# EAGLE design oa_sevenfortyfun (EAGLE 7.1.0)
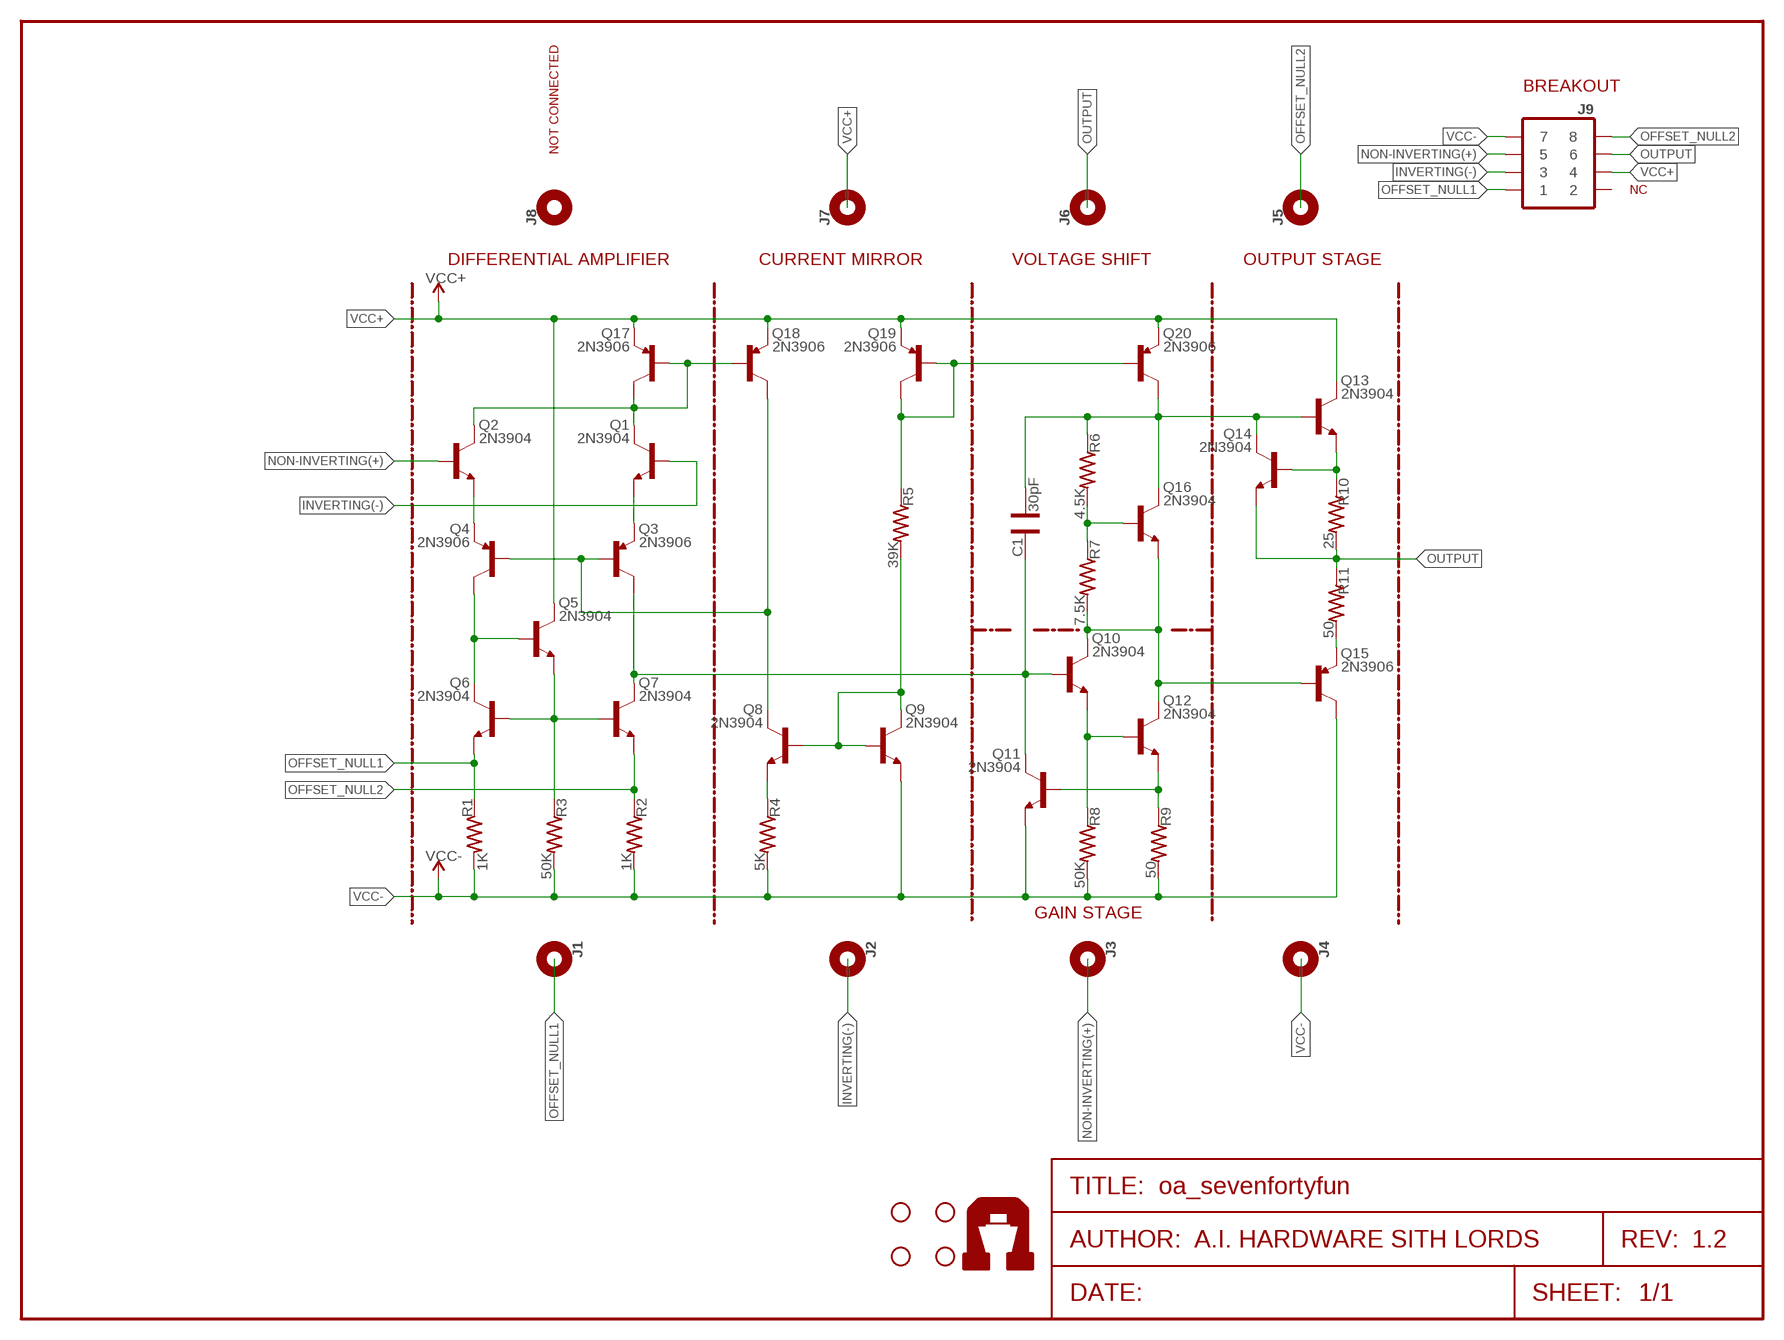
[diagram p0: schematic, sheet 1]
FRAME1 (FRAME-LETTER): AUTHOR: A.I. HARDWARE SITH LORDS; REV: 1.2

## Parts
C1  30pF  CAP025X050  [CAP-025X050]
J1  1X01-TERM  [1X01-TERM]
J2  1X01-TERM  [1X01-TERM]
J3  1X01-TERM  [1X01-TERM]
J4  1X01-TERM  [1X01-TERM]
J5  1X01-TERM  [1X01-TERM]
J6  1X01-TERM  [1X01-TERM]
J7  1X01-TERM  [1X01-TERM]
J8  1X01-TERM  [1X01-TERM]
J9  2X04SHR  [2X04-SHR]
Q1  2N3904  BJT-NPN  [TO-92-NPN]
Q2  2N3904  BJT-NPN  [TO-92-NPN]
Q3  2N3906  BJT-PNP  [TO-92-PNP]
Q4  2N3906  BJT-PNP  [TO-92-PNP]
Q5  2N3904  BJT-NPN  [TO-92-NPN]
Q6  2N3904  BJT-NPN  [TO-92-NPN]
Q7  2N3904  BJT-NPN  [TO-92-NPN]
Q8  2N3904  BJT-NPN  [TO-92-NPN]
Q9  2N3904  BJT-NPN  [TO-92-NPN]
Q10  2N3904  BJT-NPN  [TO-92-NPN]
Q11  2N3904  BJT-NPN  [TO-92-NPN]
Q12  2N3904  BJT-NPN  [TO-92-NPN]
Q13  2N3904  BJT-NPN  [TO-92-NPN]
Q14  2N3904  BJT-NPN  [TO-92-NPN]
Q15  2N3906  BJT-PNP  [TO-92-PNP]
Q16  2N3904  BJT-NPN  [TO-92-NPN]
Q17  2N3906  BJT-PNP  [TO-92-PNP]
Q18  2N3906  BJT-PNP  [TO-92-PNP]
Q19  2N3906  BJT-PNP  [TO-92-PNP]
Q20  2N3906  BJT-PNP  [TO-92-PNP]
R1  1K  RESAXIAL-0.4  [RES-AXIAL-0.4]
R2  1K  RESAXIAL-0.4  [RES-AXIAL-0.4]
R3  50K  RESAXIAL-0.4  [RES-AXIAL-0.4]
R4  5K  RESAXIAL-0.4  [RES-AXIAL-0.4]
R5  39K  RESAXIAL-0.4  [RES-AXIAL-0.4]
R6  4.5K  RESAXIAL-0.4  [RES-AXIAL-0.4]
R7  7.5K  RESAXIAL-0.4  [RES-AXIAL-0.4]
R8  50K  RESAXIAL-0.4  [RES-AXIAL-0.4]
R9  50  RESAXIAL-0.4  [RES-AXIAL-0.4]
R10  25  RESAXIAL-0.4  [RES-AXIAL-0.4]
R11  50  RESAXIAL-0.4  [RES-AXIAL-0.4]
STANDOFF1  STAND-OFF4  [STAND-OFF-4]
STANDOFF2  STAND-OFF4  [STAND-OFF-4]
STANDOFF3  STAND-OFF4  [STAND-OFF-4]
STANDOFF4  STAND-OFF4  [STAND-OFF-4]
U$3  AI-LOGOL  [AI-LOGO-L]

## Nets
INVERTING(-): J2.1 J9.3 Q1.2(B)
N$1: Q1.3(C) Q2.3(C) Q17.1(C) Q17.2(B) Q18.2(B)
N$2: Q2.1(E) Q4.3(E)
N$3: Q1.1(E) Q3.3(E)
N$4: Q4.1(C) Q5.2(B) Q6.3(C)
N$5: C1.2 Q3.1(C) Q7.3(C) Q10.2(B) Q11.3(C)
N$6: Q5.1(E) Q6.2(B) Q7.2(B) R3.P$1
N$7: Q15.3(E) R11.P$2
N$9: Q3.2(B) Q4.2(B) Q8.3(C) Q18.1(C)
N$10: Q8.1(E) R4.P$1
N$14: Q10.1(E) Q12.2(B) R8.P$1
N$15: Q19.1(C) Q19.2(B) Q20.2(B) R5.P$1
N$16: Q8.2(B) Q9.2(B) Q9.3(C) R5.P$2
N$18: Q10.3(C) Q12.3(C) Q15.2(B) Q16.1(E) R7.P$2
N$19: Q16.2(B) R6.P$2 R7.P$1
N$21: Q11.2(B) Q12.1(E) R9.P$1
N$22: C1.1 Q13.2(B) Q14.3(C) Q16.3(C) Q20.1(C) R6.P$1
N$24: Q13.1(E) Q14.2(B) R10.P$1
NON-INVERTING(+): J3.1 J9.5 Q2.2(B)
OFFSET_NULL1: J1.1 J9.1 Q6.1(E) R1.P$1
OFFSET_NULL2: J5.1 J9.8 Q7.1(E) R2.P$1
OUTPUT: J6.1 J9.6 Q14.1(E) R10.P$2 R11.P$1
VCC+: J7.1 J9.4 Q5.3(C) Q13.3(C) Q17.3(E) Q18.3(E) Q19.3(E) Q20.3(E)
VCC-: J4.1 J9.7 Q9.1(E) Q11.1(E) Q15.1(C) R1.P$2 R2.P$2 R3.P$2 R4.P$2 R8.P$2 R9.P$2
Unconnected: J8.1 J9.2

## Notes on the sheet
- BREAKOUT
- NOT CONNECTED
- NC
- DIFFERENTIAL AMPLIFIER | CURRENT MIRROR | VOLTAGE SHIFT | OUTPUT STAGE
- GAIN STAGE

## Library data of the parts
C1 = Ai_Passives:CAP
J1-J8 = Ai_Connectors:1X01-TERM
J9 = Ai_Connectors:2X04
Q1 Q2 Q5-Q14 Q16 = Ai_DiscreteSemis:BJT-NPN
Q3 Q4 Q15 Q17-Q20 = Ai_DiscreteSemis:BJT-PNP
R1-R11 = Ai_Passives:RES: Part # blah Digikey
STANDOFF1-STANDOFF4 = Ai_Electromechanical:STAND-OFF: Size #4
U$3 = Ai_Miscellany:AI-LOGO

## Net classes
0 signal: width 0.254 mm
1 power: width 0.305 mm

## Board
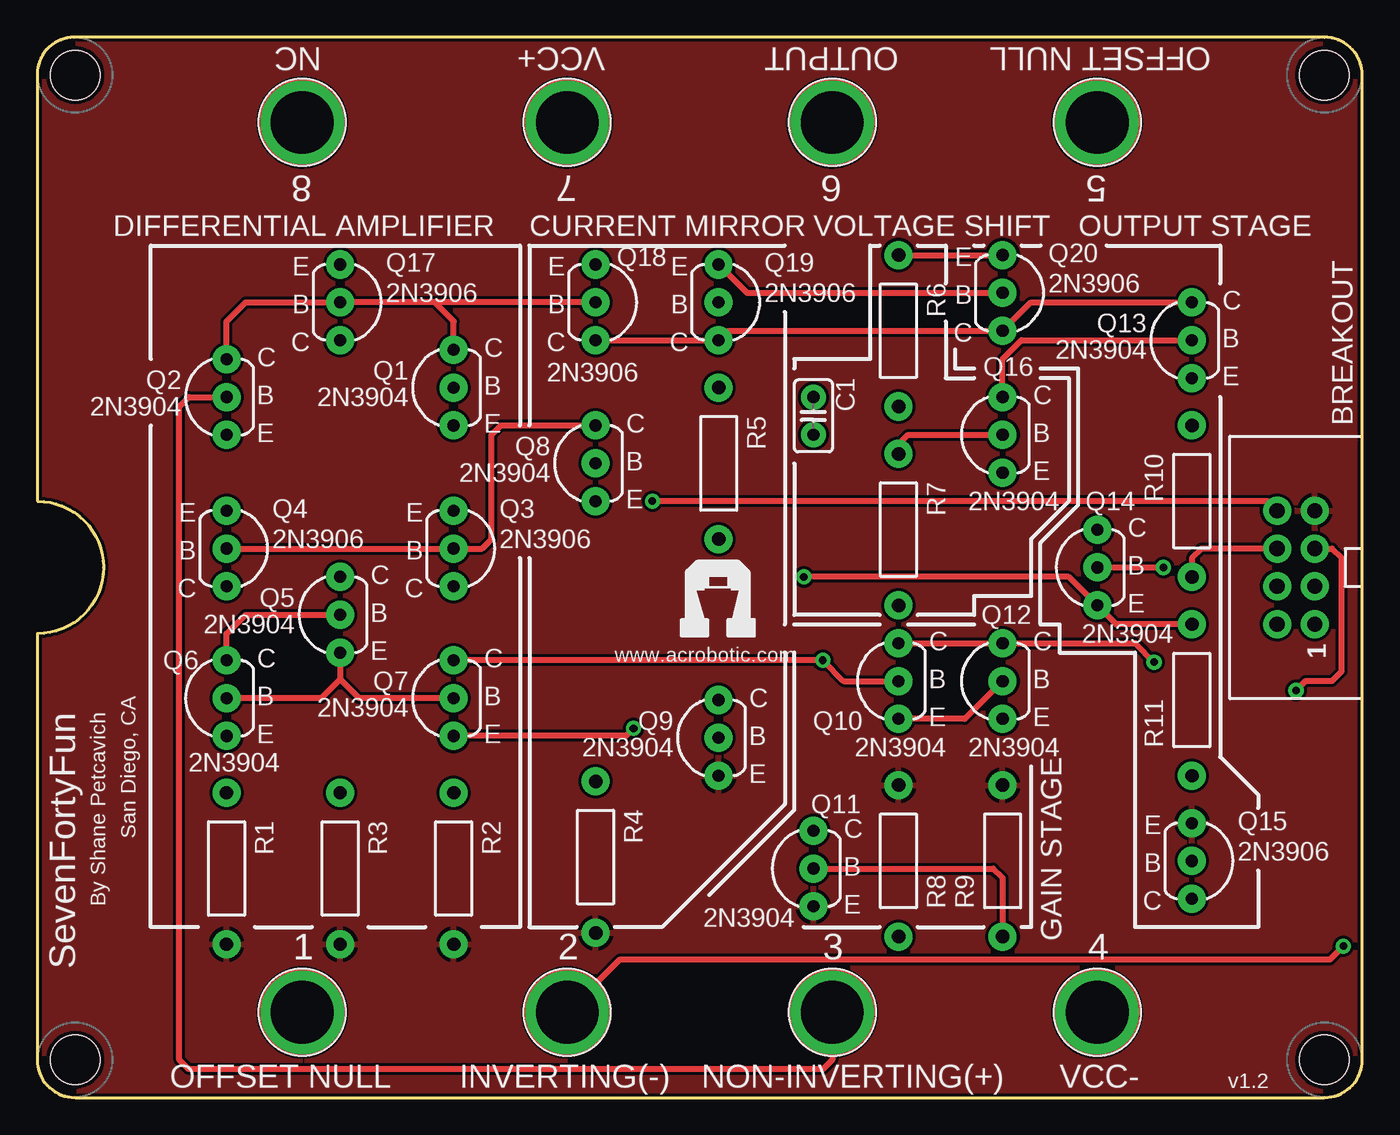
[diagram p1: board, top side]
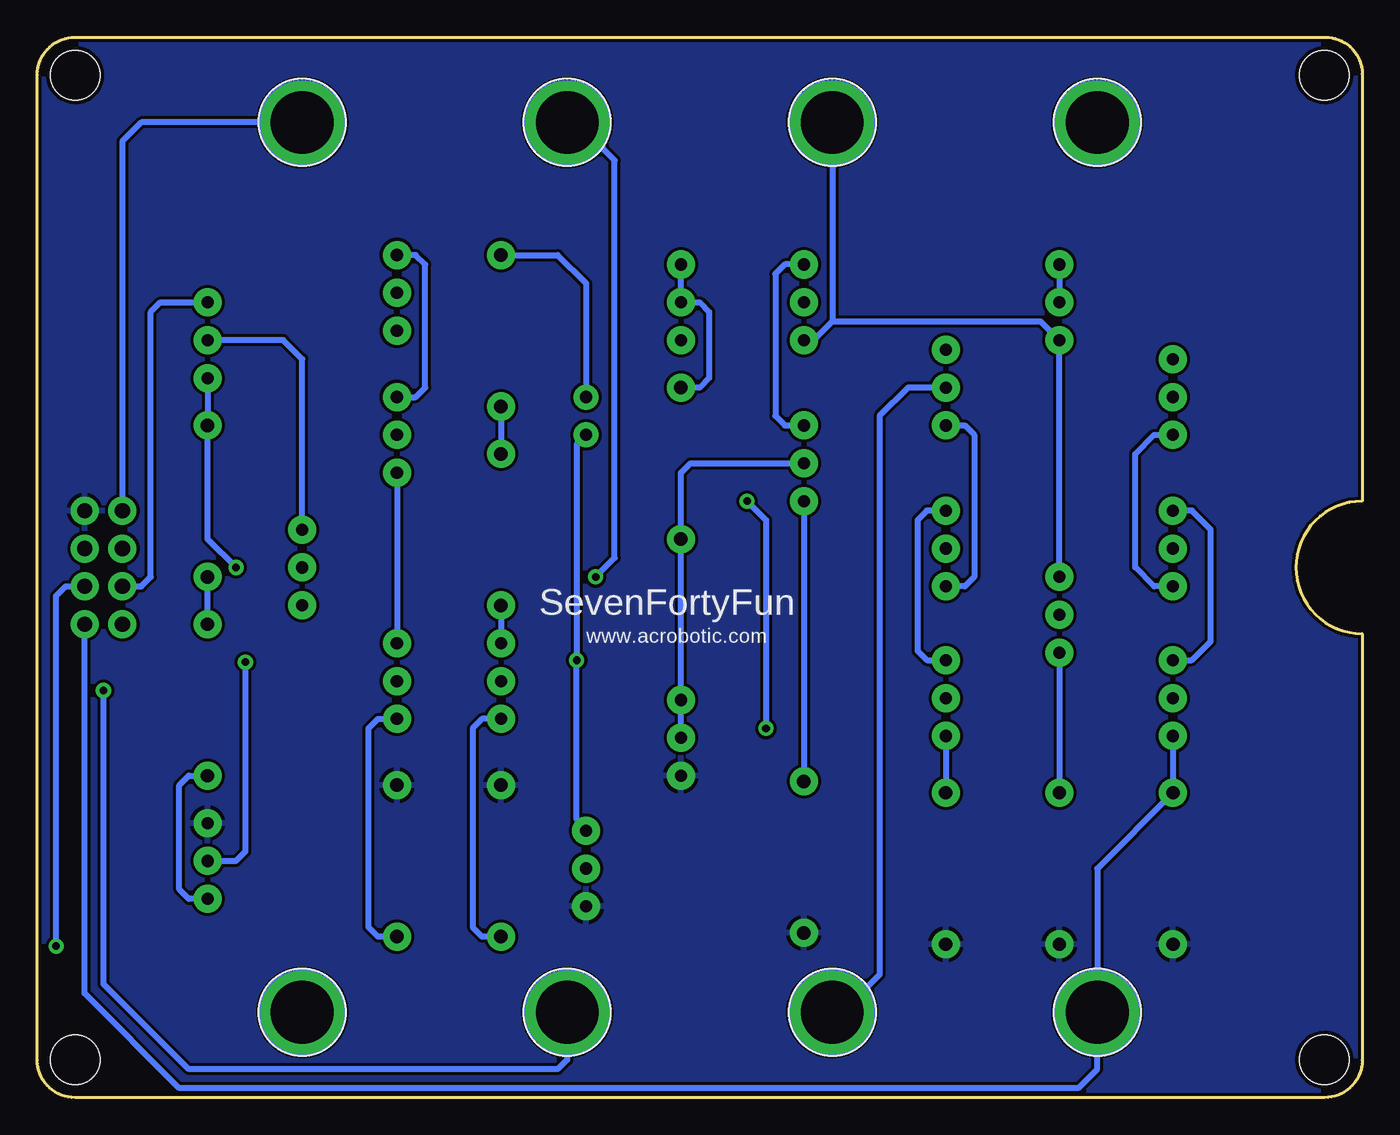
[diagram p2: board, bottom side, seen from below]

Size 88.9 x 71.12 mm. Coordinates in mm from the lower left corner, seen from the top.
Outline: 86.36,71.12 2.47,71.12 arc90 0,68.65 0,40.01 arc-180 0,31.11 0,2.54 arc90 2.54,0 86.36,0 arc90 88.9,2.54 88.9,68.58 arc90 86.36,71.12
Copper layers (1*16): Top 0.035mm / dielectric 1.5mm / Bottom 0.035mm
Design rules "ai_2layer": minimum track width 7mil, minimum drill 15mil, track to track 8mil, track to pad 8mil, pad to pad 8mil, via to via 8mil, smd to smd 8mil, copper to edge 8mil, drill to drill 8mil, minimum pad ring 12mil, minimum via ring 10mil, stop-mask expansion 4mil, vias tented up to drill 20mil, thermal gap 10mil

### Footprints (pad centres in the part's own frame; a part is rotated, then mirrored left to right if it is on the bottom)
CAP-025X050 = drill 0.813 pad 1.676: 1 -1.27,0; 2 1.27,0
1X01-TERM = drill 4.216 pad 5.588: 1 0,0
2X04-SHR = drill 1.016 pad 1.88: 1 -3.81,-1.27; 2 -3.81,1.27; 3 -1.27,-1.27; 4 -1.27,1.27; 5 1.27,-1.27; 6 1.27,1.27; 7 3.81,-1.27; 8 3.81,1.27
TO-92-NPN = drill 0.813 pad 1.88: 1 0,-2.54; 2 0,0; 3 0,2.54
TO-92-PNP = drill 0.813 pad 1.88: 1 0,2.54; 2 0,0; 3 0,-2.54
RES-AXIAL-0.4 = drill 0.9 pad 1.88: P$1 -5.08,0; P$2 5.08,0
STAND-OFF-4 = hole 3.302: 0,0

### Placement (x,y rotation side)
C1  52.07,45.72 270 top
J1  17.78,5.71 0 top
J2  35.56,5.71 0 top
J3  53.34,5.71 0 top
J4  71.12,5.71 0 top
J5  71.12,65.41 0 top
J6  53.34,65.41 0 top
J7  35.56,65.41 0 top
J8  17.78,65.41 0 top
J9  84.45,35.56 90 top
Q1  27.94,47.62 0 top
Q2  12.7,46.99 0 top
Q3  27.94,36.83 0 top
Q4  12.7,36.83 0 top
Q5  20.32,32.38 0 top
Q6  12.7,26.8 0 top
Q7  27.94,26.8 0 top
Q8  37.47,42.55 0 top
Q9  45.72,24.13 0 top
Q10  57.78,27.94 0 top
Q11  52.07,15.37 0 top
Q12  64.77,27.94 0 top
Q13  77.47,50.8 0 top
Q14  71.12,35.56 0 top
Q15  77.47,15.88 0 top
Q16  64.77,44.45 0 top
Q17  20.32,53.34 0 top
Q18  37.47,53.34 0 top
Q19  45.72,53.34 0 top
Q20  64.77,53.98 0 top
R1  12.7,15.37 270 top
R2  27.94,15.37 270 top
R3  20.32,15.37 270 top
R4  37.47,16.13 270 top
R5  45.72,42.55 270 top
R6  57.78,51.44 270 top
R7  57.78,38.1 270 top
R8  57.78,15.88 90 top
R9  64.77,15.88 90 top
R10  77.47,40.01 270 top
R11  77.47,26.67 270 top
STANDOFF1  2.54,2.54 0 top
STANDOFF2  86.36,2.54 0 top
STANDOFF3  2.54,68.58 0 top
STANDOFF4  86.36,68.58 0 top
U$3  45.72,33.02 0 top

### Tracks (layer width: path | path; a pad name or v marks a point on that pad's centre or on a via)
INVERTING(-)  (via drill 0.51)
  Top 0.406: J2.1 39.12,9.27 86.74,9.27 v87.63,10.16
  Bottom 0.406: Q1.2 30.48,47.62 32.38,45.72 32.38,8.26 34.92,5.71 J2.1 | v87.63,10.16 87.63,33.66 87,34.29 J9.3
N$1
  Top 0.406: Q2.3 12.7,52.07 13.97,53.34 Q17.2 26.67,53.34 | Q1.3 27.94,52.07 26.67,53.34 | Q18.2 26.67,53.34
  Bottom 0.406: Q17.1 Q17.2
N$2
  Bottom 0.406: Q4.3 13.97,34.29 15.24,35.56 15.24,43.18 13.97,44.45 Q2.1
N$3
  Bottom 0.406: Q1.1 26.67,45.09 26.04,44.45 26.04,34.92 26.67,34.29 Q3.3
N$4
  Top 0.406: Q6.3 12.7,31.11 13.97,32.38 Q5.2
  Bottom 0.406: Q6.3 11.43,29.34 10.16,30.61 10.16,38.1 11.43,39.37 Q4.1
N$5  (via drill 0.51)
  Top 0.406: Q10.2 54.1,27.94 v52.7,29.34 Q7.3
  Bottom 0.406: C1.2 52.7,43.81 v52.7,29.34 52.7,18.67 Q11.3 | Q3.1 29.21,39.37 29.84,38.73 29.84,29.97 29.21,29.34 Q7.3
N$6
  Top 0.406: Q5.1 20.32,28.07 | 20.32,28.07 19.05,26.8 Q6.2 | Q7.2 21.59,26.8 20.32,28.07
  Bottom 0.406: Q5.1 R3.P$1
N$7
  Bottom 0.406: Q15.3 78.74,13.34 79.38,13.97 79.38,20.95 78.74,21.59 R11.P$2
N$9
  Top 0.406: Q8.3 31.11,45.09 30.48,44.45 30.48,37.47 29.84,36.83 Q3.2 Q4.2
  Bottom 0.406: Q18.1 38.73,55.88 39.37,55.24 39.37,45.72 38.73,45.09 Q8.3
N$10
  Bottom 0.406: Q8.1 R4.P$1
N$14
  Top 0.406: Q12.2 62.23,25.4 Q10.1
  Bottom 0.406: Q10.1 59.05,25.4 59.69,24.77 59.69,11.43 59.05,10.79 R8.P$1
N$15
  Top 0.406: Q19.1 47.62,53.98 Q20.2
  Bottom 0.406: Q19.1 Q19.2 44.45,53.34 43.81,52.7 43.81,48.26 44.45,47.62 R5.P$1
N$16
  Bottom 0.406: Q9.2 Q9.3 R5.P$2 45.72,41.91 45.09,42.55 Q8.2
N$18  (via drill 0.51)
  Top 0.406: v74.93,29.21 73.66,30.48 Q12.3 Q10.3
  Bottom 0.406: Q15.2 75.56,15.88 74.93,16.51 v74.93,29.21 | R7.P$2 Q10.3 | Q16.1 Q12.3
N$19
  Top 0.406: R7.P$1 57.78,43.81 58.42,44.45 Q16.2
  Bottom 0.406: R6.P$2 R7.P$1
N$21
  Top 0.406: Q11.2 64.14,15.37 64.77,14.73 R9.P$1
  Bottom 0.406: Q12.1 66.04,25.4 66.67,24.77 66.67,11.43 66.04,10.79 R9.P$1
N$22
  Top 0.406: R6.P$1 Q20.1 | Q16.3 64.77,49.53 66.04,50.8 Q13.2
  Bottom 0.406: Q16.3 63.5,46.99 62.87,47.62 62.87,55.88 63.5,56.52 Q20.1 | R6.P$1 53.98,56.52 52.07,54.61 C1.1 | Q14.3 71.12,49.53 72.39,50.8 Q13.2
N$24  (via drill 0.51)
  Top 0.406: Q14.2 v75.56,35.56
  Bottom 0.406: Q13.1 R10.P$1 77.47,37.47 v75.56,35.56
NON-INVERTING(+)  (via drill 0.51)
  Top 0.406: J3.1 53.34,2.54 52.7,1.91 10.16,1.91 9.53,2.54 9.53,46.35 10.16,46.99 Q2.2 | J9.5 86.87,36.83 87.5,36.2 87.5,28.57 86.87,27.94 85.09,27.94 v84.45,27.3
  Bottom 0.406: J3.1 53.34,2.54 53.98,1.91 78.74,1.91 84.45,7.62 v84.45,27.3
OFFSET_NULL1
  Bottom 0.406: Q6.1 R1.P$1 17.78,15.37 J1.1 17.78,1.91 19.05,0.64 79.38,0.64 85.72,6.99 J9.1
OFFSET_NULL2  (via drill 0.51)
  Top 0.406: J9.8 82.55,40.01 v41.27,40.01 | v40.01,24.77 39.5,24.26 Q7.1
  Bottom 0.406: Q7.1 R2.P$1 | J5.1 81.92,65.41 83.19,64.14 J9.8 | v41.27,40.01 40.01,38.73 v40.01,24.77
OUTPUT  (via drill 0.51)
  Top 0.406: R11.P$1 72.39,31.75 Q14.1 69.22,34.92 v51.44,34.92 | J9.6 78.11,36.83 77.47,36.2 R10.P$2
  Bottom 0.406: R11.P$1 R10.P$2 | v51.44,34.92 50.16,36.2 50.16,62.87 52.7,65.41 J6.1
VCC+
  Top 0.406: Q18.3 Q19.3 46.35,51.44 Q20.3 66.67,53.34 Q13.3
  Bottom 0.406: Q5.3 Q17.3 21.59,52.07 35.56,52.07 | J7.1 35.56,52.07 | 35.56,52.07 36.83,50.8 Q18.3 | J9.4 81.92,34.29 81.28,34.92 81.28,52.7 80.64,53.34 Q13.3
VCC-
  pour Bottom: 0,71.12 88.9,71.12 88.9,0 0,0
  pour Top: 0,0 0,71.12 88.9,71.12 88.9,0

### Text on the board
tPlace: NC | VCC+ | OUTPUT | OFFSET NULL | 8 | 7 | 6 | 5 | DIFFERENTIAL AMPLIFIER | CURRENT MIRROR | VOLTAGE SHIFT | OUTPUT STAGE | BREAKOUT | www.acrobotic.com | GAIN STAGE | San Diego, CA | By Shane Petcavich | SevenFortyFun | 1 | 2 | 3 | 4 | OFFSET NULL | INVERTING(-) | NON-INVERTING(+) | VCC- | v1.2
bPlace: SevenFortyFun | www.acrobotic.com